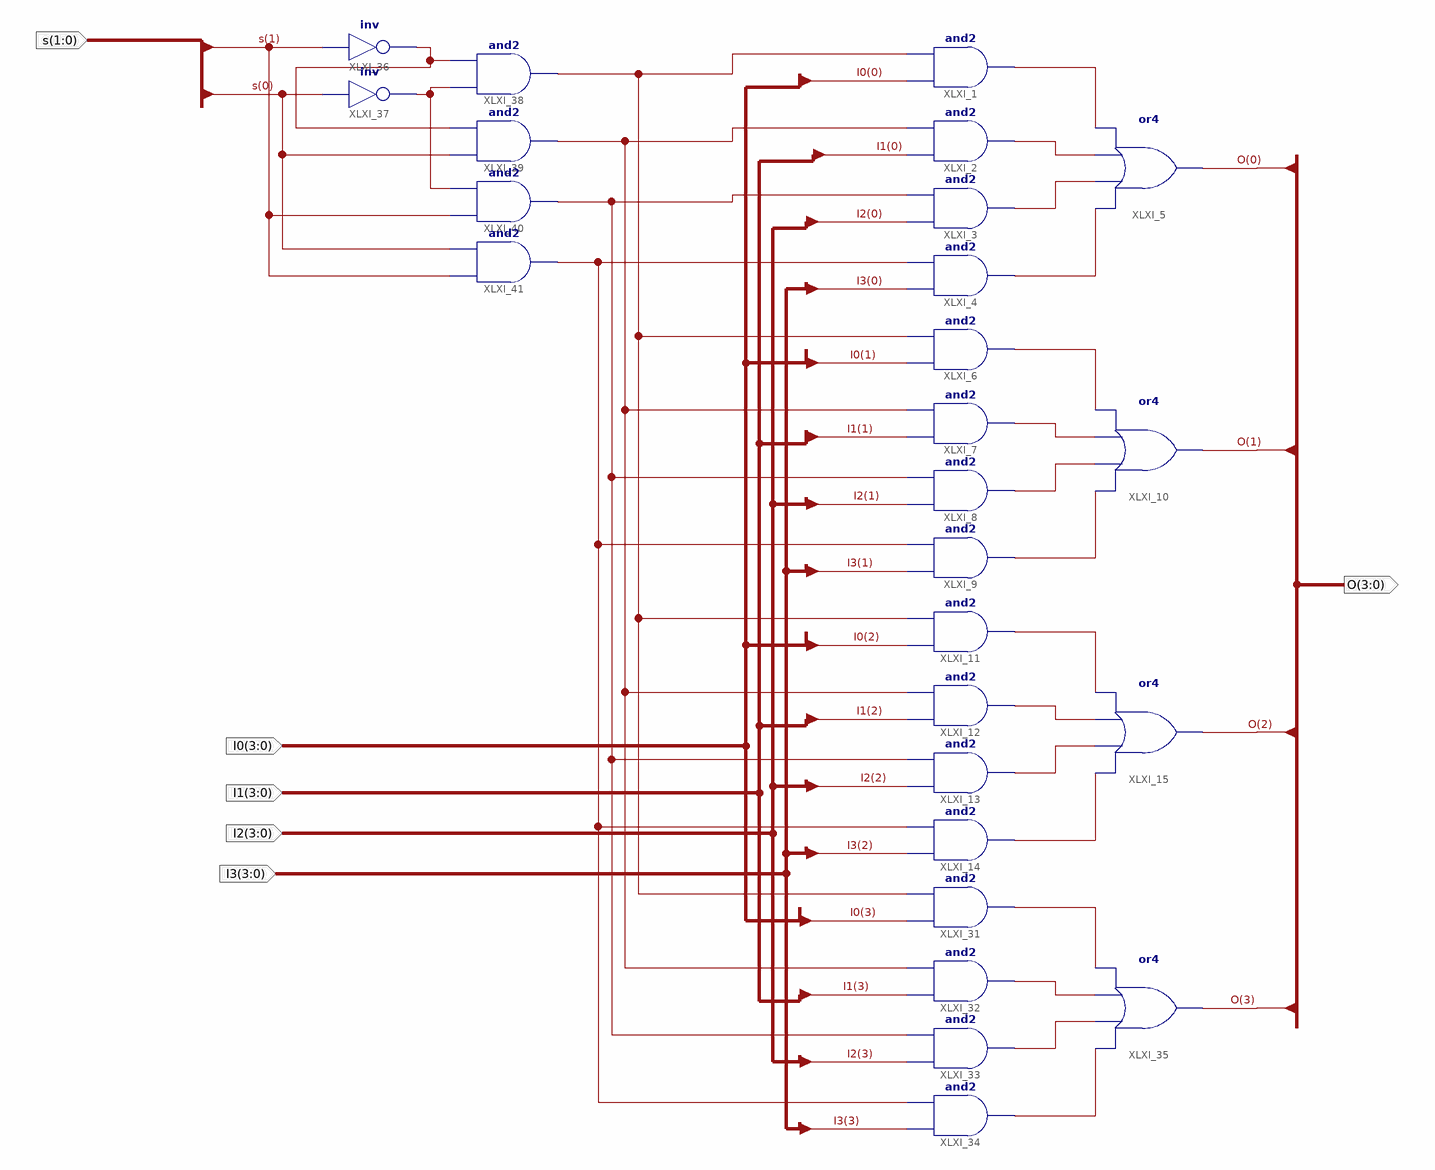
[diagram p0: schematic sheet 1]
// Xilinx ISE schematic MUX4T1_4.sch (kintex7) as structural Verilog: 26 symbols, 6 ports
module MUX4T1_4 (
  input  [1:0] s,
  input  [3:0] I0,
  input  [3:0] I1,
  input  [3:0] I2,
  input  [3:0] I3,
  output [3:0] O
);

  wire XLXN_1, XLXN_2, XLXN_4, XLXN_5, XLXN_6, XLXN_7, XLXN_8, XLXN_9, XLXN_10, XLXN_11, XLXN_12, XLXN_13,
       XLXN_26, XLXN_27, XLXN_28, XLXN_29, XLXN_41, XLXN_43, XLXN_50, XLXN_54, XLXN_58, XLXN_62;

  and XLXI_1 (XLXN_1, I0[0], XLXN_50);
  and XLXI_2 (XLXN_2, I1[0], XLXN_54);
  and XLXI_3 (XLXN_4, I2[0], XLXN_58);
  and XLXI_4 (XLXN_5, I3[0], XLXN_62);
  or XLXI_5 (O[0], XLXN_5, XLXN_4, XLXN_2, XLXN_1);
  and XLXI_6 (XLXN_6, I0[1], XLXN_50);
  and XLXI_7 (XLXN_7, I1[1], XLXN_54);
  and XLXI_8 (XLXN_8, I2[1], XLXN_58);
  and XLXI_9 (XLXN_9, I3[1], XLXN_62);
  or XLXI_10 (O[1], XLXN_9, XLXN_8, XLXN_7, XLXN_6);
  and XLXI_11 (XLXN_10, I0[2], XLXN_50);
  and XLXI_12 (XLXN_11, I1[2], XLXN_54);
  and XLXI_13 (XLXN_12, I2[2], XLXN_58);
  and XLXI_14 (XLXN_13, I3[2], XLXN_62);
  or XLXI_15 (O[2], XLXN_13, XLXN_12, XLXN_11, XLXN_10);
  and XLXI_31 (XLXN_26, I0[3], XLXN_50);
  and XLXI_32 (XLXN_27, I1[3], XLXN_54);
  and XLXI_33 (XLXN_28, I2[3], XLXN_58);
  and XLXI_34 (XLXN_29, I3[3], XLXN_62);
  or XLXI_35 (O[3], XLXN_29, XLXN_28, XLXN_27, XLXN_26);
  not XLXI_36 (XLXN_41, s[1]);
  not XLXI_37 (XLXN_43, s[0]);
  and XLXI_38 (XLXN_50, XLXN_43, XLXN_41);
  and XLXI_39 (XLXN_54, s[0], XLXN_41);
  and XLXI_40 (XLXN_58, s[1], XLXN_43);
  and XLXI_41 (XLXN_62, s[1], s[0]);
endmodule
